# Altium schematic sheet 14_BTB连接器.schdoc
size 431 x 309 mm; Symbol: Sheet-Symbol_A4; Device: Sheet-Symbol_A4; Company: 嘉立创EDA; Version: V1.0; Page Size: A4; @Project Name: RK3568核心板; @Page Count: 13; @Update Date: 2024-10-10; @Create Date: 2024-10-10; @Schematic Name: Schematic1; @Page No: 13; @Page Name: BTB连接器; @Board Name: Board1; @Create Time: 15:04:26; @Update Time: 16:52:17; Width: 1655; Height: 1170; Region Start: 1; X Region Count: 6; Y Region Count: 4; Blade Width: 10; Title Block Position: 3
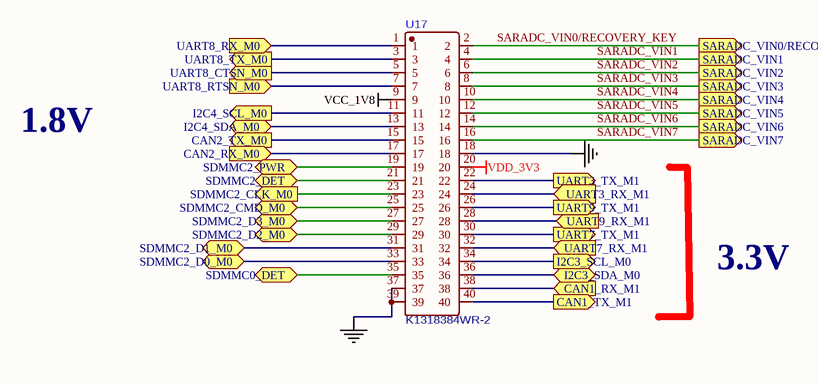
[diagram p0: 14_BTB连接器.schdoc]

## Parts
U17  K1318384WR-2  [CONN-TH_K1318384WR-2]

## Ports
CAN1_RX_M1 (in), CAN1_TX_M1 (out), CAN2_RX_M0 (in), CAN2_TX_M0 (out), I2C3_SCL_M0 (out), I2C3_SDA_M0 (bidir), I2C4_SCL_M0 (out), I2C4_SDA_M0 (bidir), SARADC_VIN0/RECOVERY_KEY (out), SARADC_VIN1 (out), SARADC_VIN2 (out), SARADC_VIN3 (out), SARADC_VIN4 (out), SARADC_VIN5 (out), SARADC_VIN6 (out), SARADC_VIN7 (out), SDMMC0_DET (bidir), SDMMC2_CLK_M0 (out), SDMMC2_CMD_M0 (bidir), SDMMC2_D0_M0 (bidir), SDMMC2_D1_M0 (bidir), SDMMC2_D2_M0 (bidir), SDMMC2_D3_M0 (bidir), SDMMC2_DET (bidir), SDMMC2_PWR (bidir), UART3_RX_M1 (in), UART3_TX_M1 (out), UART7_RX_M1 (in), UART7_TX_M1 (out), UART8_CTSN_M0 (out), UART8_RTSN_M0 (in), UART8_RX_M0 (in), UART8_TX_M0 (out), UART9_RX_M1 (in), UART9_TX_M1 (out)

## Nets
GND: U17.18 U17.37 U17.39
VCC_1V8: U17.9
VDD_3V3: U17.20
CAN1_RX_M1: U17.38 ; port CAN1_RX_M1
CAN1_TX_M1: U17.40 ; port CAN1_TX_M1
CAN2_RX_M0: U17.17 ; port CAN2_RX_M0
CAN2_TX_M0: U17.15 ; port CAN2_TX_M0
I2C3_SCL_M0: U17.34 ; port I2C3_SCL_M0
I2C3_SDA_M0: U17.36 ; port I2C3_SDA_M0
I2C4_SCL_M0: U17.11 ; port I2C4_SCL_M0
I2C4_SDA_M0: U17.13 ; port I2C4_SDA_M0
SARADC_VIN0/RECOVERY_KEY: U17.2 ; port SARADC_VIN0/RECOVERY_KEY
SARADC_VIN1: U17.4 ; port SARADC_VIN1
SARADC_VIN2: U17.6 ; port SARADC_VIN2
SARADC_VIN3: U17.8 ; port SARADC_VIN3
SARADC_VIN4: U17.10 ; port SARADC_VIN4
SARADC_VIN5: U17.12 ; port SARADC_VIN5
SARADC_VIN6: U17.14 ; port SARADC_VIN6
SARADC_VIN7: U17.16 ; port SARADC_VIN7
SDMMC0_DET: U17.35 ; port SDMMC0_DET
SDMMC2_CLK_M0: U17.23 ; port SDMMC2_CLK_M0
SDMMC2_CMD_M0: U17.25 ; port SDMMC2_CMD_M0
SDMMC2_D0_M0: U17.33 ; port SDMMC2_D0_M0
SDMMC2_D1_M0: U17.31 ; port SDMMC2_D1_M0
SDMMC2_D2_M0: U17.29 ; port SDMMC2_D2_M0
SDMMC2_D3_M0: U17.27 ; port SDMMC2_D3_M0
SDMMC2_DET: U17.21 ; port SDMMC2_DET
SDMMC2_PWR: U17.19 ; port SDMMC2_PWR
UART3_RX_M1: U17.24 ; port UART3_RX_M1
UART3_TX_M1: U17.22 ; port UART3_TX_M1
UART7_RX_M1: U17.32 ; port UART7_RX_M1
UART7_TX_M1: U17.30 ; port UART7_TX_M1
UART8_CTSN_M0: U17.5 ; port UART8_CTSN_M0
UART8_RTSN_M0: U17.7 ; port UART8_RTSN_M0
UART8_RX_M0: U17.1 ; port UART8_RX_M0
UART8_TX_M0: U17.3 ; port UART8_TX_M0
UART9_RX_M1: U17.28 ; port UART9_RX_M1
UART9_TX_M1: U17.26 ; port UART9_TX_M1

## Notes on the sheet
- 1.8V
- 3.3V
- 1
- 2
- 3
- 4
- 5
- 6
- A
- B
- C
- D
- 原理图
- Schematic1
- 创建日期
- 更新日期
- 2024-10-10
- 审阅
- 绘制
- 图页
- BTB连接器
- 物料编码
- RK3568核心板
- 版本
- 尺寸
- 页
- 13
- 共
- V1.0
- A4
- 嘉立创EDA

## Library data of the parts
U17 = K1318384WR-2: 排针